# Altium schematic sheet 04 USB7002-PartA.SchDoc: USB7002 - Part A
size 420 x 297 mm; SheetNumber: 3; SheetTotal: 7
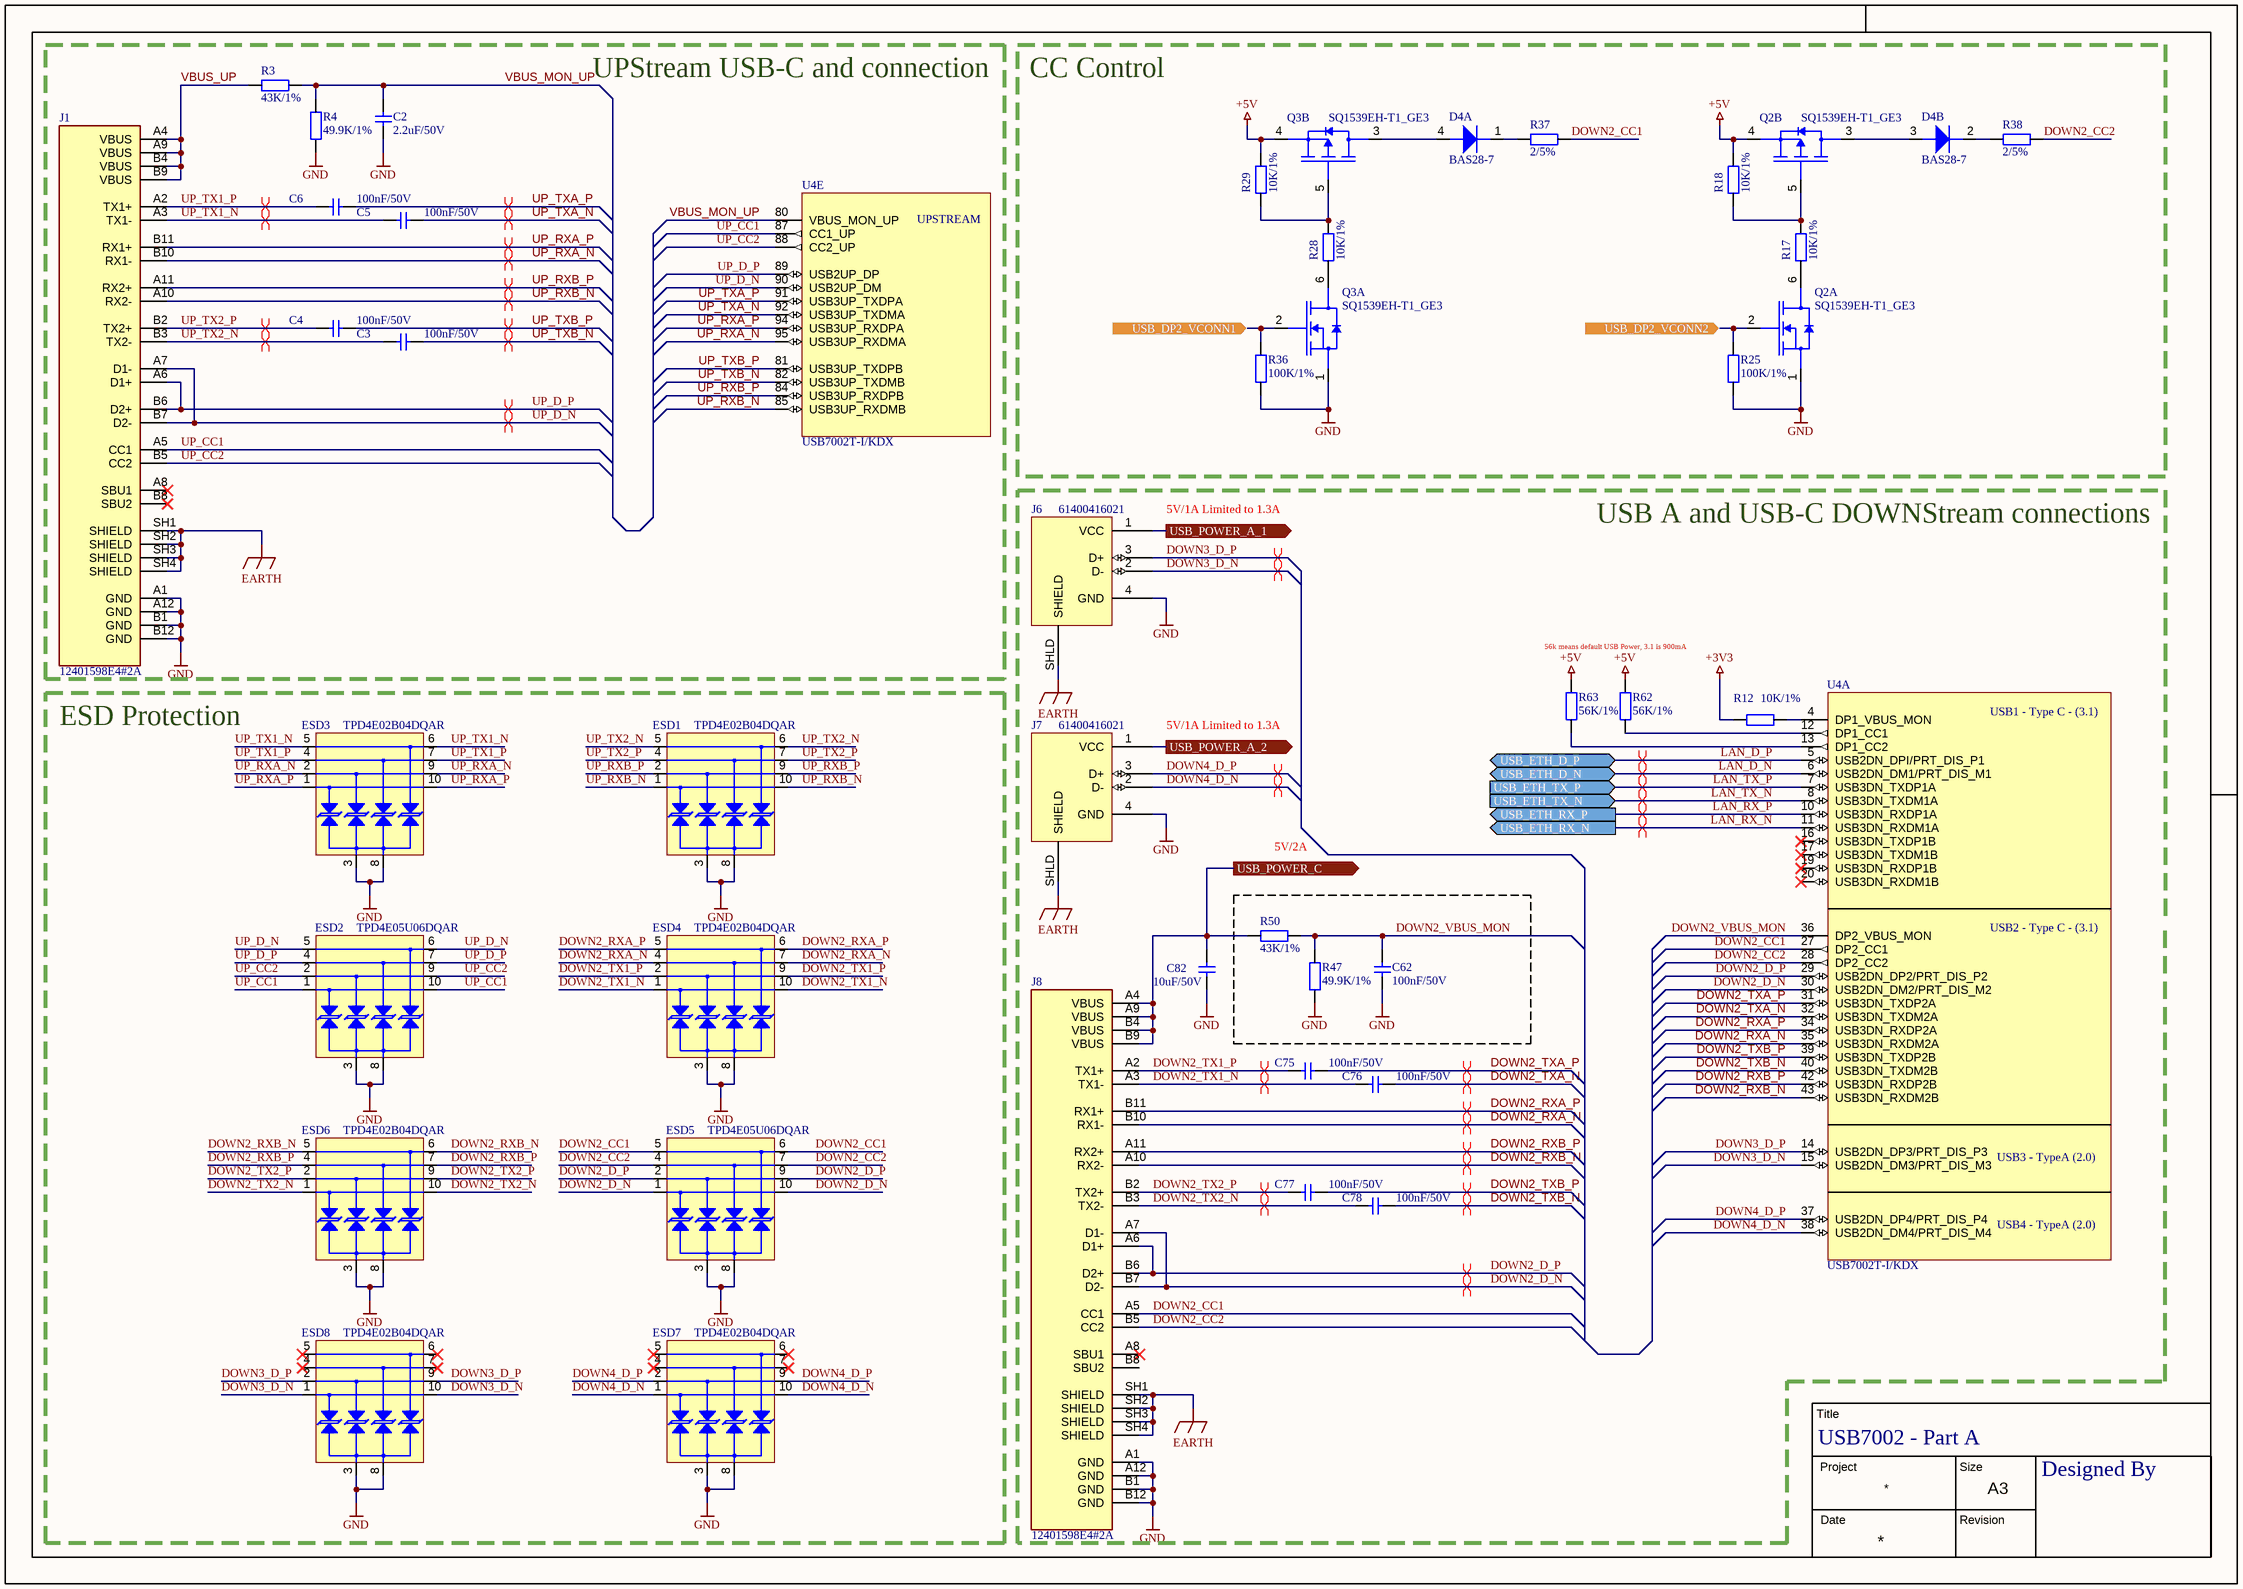
[diagram p0: 04 USB7002-PartA.SchDoc]

## Parts
C2  2.2uF/50V  [INDC1608X10N]
C3  100nF/50V  [CAPC1005X06N]
C4  100nF/50V  [CAPC1005X06N]
C5  100nF/50V  [CAPC1005X06N]
C6  100nF/50V  [CAPC1005X06N]
C62  100nF/50V  [CAPC1005X06N]
C75  100nF/50V  [CAPC1005X06N]
C76  100nF/50V  [CAPC1005X06N]
C77  100nF/50V  [CAPC1005X06N]
C78  100nF/50V  [CAPC1005X06N]
C82  10uF/50V  [CAPC3216X18N]
D4  BAS28-7  [SOT190P238X100-4L]  (parts A,B of 2)
ESD1  TPD4E02B04DQAR  [USON50P11X26X055]
ESD2  TPD4E05U06DQAR  [USON50P11X26X055]
ESD3  TPD4E02B04DQAR  [USON50P11X26X055]
ESD4  TPD4E02B04DQAR  [USON50P11X26X055]
ESD5  TPD4E05U06DQAR  [USON50P11X26X055]
ESD6  TPD4E02B04DQAR  [USON50P11X26X055]
ESD7  TPD4E02B04DQAR  [USON50P11X26X055]
ESD8  TPD4E02B04DQAR  [USON50P11X26X055]
J1  12401598E4#2A  [12401598E4#2A]
J6  61400416021  [61400416021]
J7  61400416021  [61400416021]
J8  12401598E4#2A  [12401598E4#2A]
Q2  SQ1539EH-T1_GE3  [SOT65P195X110-6N]  (parts A,B of 2)
Q3  SQ1539EH-T1_GE3  [SOT65P195X110-6N]  (parts A,B of 2)
R3  43K/1%  [RESC1005X04N]
R4  49.9K/1%  [RESC1005X04N]
R12  10K/1%  [RESC1005X04N]
R17  10K/1%  [RESC1005X04N]
R18  10K/1%  [RESC1005X04N]
R25  100K/1%  [RESC1005X04N]
R28  10K/1%  [RESC1005X04N]
R29  10K/1%  [RESC1005X04N]
R36  100K/1%  [RESC1005X04N]
R37  2/5%  [RESC1608X04N]
R38  2/5%  [RESC1608X04N]
R47  49.9K/1%  [RESC1005X04N]
R50  43K/1%  [RESC1005X04N]
R62  56K/1%  [RESC1005X04N]
R63  56K/1%  [RESC1005X04N]
U4  USB7002T-I/KDX  [QFN40P1200X1200X90_HS-101N]  (parts A,E of 5)

## Blocks framed on the sheet
UPStream USB-C and connection: C2-C6 J1 R3 R4 U4
CC Control: D4 Q2 Q3 R17 R18 R25 R28 R29 R36-R38
USB A and USB-C DOWNStream connections: C62 C75-C78 C82 J6-J8 R12 R47 R50 R62 R63 U4
ESD Protection: ESD1-ESD8

## Ports
USB_DP2_VCONN1 (in), USB_DP2_VCONN2 (in), USB_ETH_D_N (bidir), USB_ETH_D_P (bidir), USB_ETH_RX_N (out), USB_ETH_RX_P (out), USB_ETH_TX_N (in), USB_ETH_TX_P (in), USB_POWER_A_1 (out), USB_POWER_A_2 (out), USB_POWER_C (out)

## Nets
+3V3: R12.1
+5V: Q2.4 Q3.4 R18.1 R29.1 R62.1 R63.1
EARTH: J1.SH1(SHIELD) J1.SH2(SHIELD) J1.SH3(SHIELD) J1.SH4(SHIELD) J6.SHLD(SHIELD) J7.SHLD(SHIELD) J8.SH1(SHIELD) J8.SH2(SHIELD) J8.SH3(SHIELD) J8.SH4(SHIELD)
GND: C2.1 C62.2 C82.1 ESD1.3(GND) ESD1.8(GND) ESD2.3(GND) ESD2.8(GND) ESD3.3(GND) ESD3.8(GND) ESD4.3(GND) ESD4.8(GND) ESD5.3(GND) ESD5.8(GND) ESD6.3(GND) ESD6.8(GND) ESD7.3(GND) ESD7.8(GND) ESD8.3(GND) ESD8.8(GND) J1.A1(GND) J1.A12(GND) J1.B1(GND) J1.B12(GND) J6.4(GND) J7.4(GND) J8.A1(GND) J8.A12(GND) J8.B1(GND) J8.B12(GND) Q2.1(S1) Q3.1(S1) R4.1 R25.2 R36.2 R47.1
DOWN2_CC1: ESD5.5(IO4) ESD5.6(NC) J8.A5(CC1) R37.2 U4.27(DP2_CC1)
DOWN2_CC2: ESD5.4(IO3) ESD5.7(NC) J8.B5(CC2) R38.2 U4.28(DP2_CC2)
DOWN2_D_N: ESD5.1(IO1) ESD5.10(NC) J8.A7(D1-) J8.B7(D2-) U4.30(USB2DN_DM2/PRT_DIS_M2)
DOWN2_D_P: ESD5.2(IO2) ESD5.9(NC) J8.A6(D1+) J8.B6(D2+) U4.29(USB2DN_DP2/PRT_DIS_P2)
DOWN2_RXA_N: ESD4.4(IO3) ESD4.7(NC) J8.B10(RX1-) U4.35(USB3DN_RXDM2A)
DOWN2_RXA_P: ESD4.5(IO4) ESD4.6(NC) J8.B11(RX1+) U4.34(USB3DN_RXDP2A)
DOWN2_RXB_N: ESD6.5(IO4) ESD6.6(NC) J8.A10(RX2-) U4.43(USB3DN_RXDM2B)
DOWN2_RXB_P: ESD6.4(IO3) ESD6.7(NC) J8.A11(RX2+) U4.42(USB3DN_RXDP2B)
DOWN2_TX1_N: C76.2 ESD4.1(IO1) ESD4.10(NC) J8.A3(TX1-)
DOWN2_TX1_P: C75.2 ESD4.2(IO2) ESD4.9(NC) J8.A2(TX1+)
DOWN2_TX2_N: C78.2 ESD6.1(IO1) ESD6.10(NC) J8.B3(TX2-)
DOWN2_TX2_P: C77.2 ESD6.2(IO2) ESD6.9(NC) J8.B2(TX2+)
DOWN2_TXA_N: C76.1 U4.32(USB3DN_TXDM2A)
DOWN2_TXA_P: C75.1 U4.31(USB3DN_TXDP2A)
DOWN2_TXB_N: C78.1 U4.40(USB3DN_TXDM2B)
DOWN2_TXB_P: C77.1 U4.39(USB3DN_TXDP2B)
DOWN2_VBUS_MON: C62.1 R47.2 R50.1 U4.36(DP2_VBUS_MON)
DOWN3_D_N: ESD8.1(IO1) ESD8.10(NC) J6.2(D-) U4.15(USB2DN_DM3/PRT_DIS_M3)
DOWN3_D_P: ESD8.2(IO2) ESD8.9(NC) J6.3(D+) U4.14(USB2DN_DP3/PRT_DIS_P3)
DOWN4_D_N: ESD7.1(IO1) ESD7.10(NC) J7.2(D-) U4.38(USB2DN_DM4/PRT_DIS_M4)
DOWN4_D_P: ESD7.2(IO2) ESD7.9(NC) J7.3(D+) U4.37(USB2DN_DP4/PRT_DIS_P4)
LAN_D_N: U4.6(USB2DN_DM1/PRT_DIS_M1) ; port USB_ETH_D_N
LAN_D_P: U4.5(USB2DN_DPI/PRT_DIS_P1) ; port USB_ETH_D_P
LAN_RX_N: U4.11(USB3DN_RXDM1A) ; port USB_ETH_RX_N
LAN_RX_P: U4.10(USB3DN_RXDP1A) ; port USB_ETH_RX_P
LAN_TX_N: U4.8(USB3DN_TXDM1A) ; port USB_ETH_TX_N
LAN_TX_P: U4.7(USB3DN_TXDP1A) ; port USB_ETH_TX_P
UP_CC1: ESD2.1(IO1) ESD2.10(NC) J1.A5(CC1) U4.87(CC1_UP)
UP_CC2: ESD2.2(IO2) ESD2.9(NC) J1.B5(CC2) U4.88(CC2_UP)
UP_D_N: ESD2.5(IO4) ESD2.6(NC) J1.A7(D1-) J1.B7(D2-) U4.90(USB2UP_DM)
UP_D_P: ESD2.4(IO3) ESD2.7(NC) J1.A6(D1+) J1.B6(D2+) U4.89(USB2UP_DP)
UP_RXA_N: ESD3.2(IO2) ESD3.9(NC) J1.B10(RX1-) U4.95(USB3UP_RXDMA)
UP_RXA_P: ESD3.1(IO1) ESD3.10(NC) J1.B11(RX1+) U4.94(USB3UP_RXDPA)
UP_RXB_N: ESD1.1(IO1) ESD1.10(NC) J1.A10(RX2-) U4.85(USB3UP_RXDMB)
UP_RXB_P: ESD1.2(IO2) ESD1.9(NC) J1.A11(RX2+) U4.84(USB3UP_RXDPB)
UP_TX1_N: C5.2 ESD3.5(IO4) ESD3.6(NC) J1.A3(TX1-)
UP_TX1_P: C6.2 ESD3.4(IO3) ESD3.7(NC) J1.A2(TX1+)
UP_TX2_N: C3.2 ESD1.5(IO4) ESD1.6(NC) J1.B3(TX2-)
UP_TX2_P: C4.2 ESD1.4(IO3) ESD1.7(NC) J1.B2(TX2+)
UP_TXA_N: C5.1 U4.92(USB3UP_TXDMA)
UP_TXA_P: C6.1 U4.91(USB3UP_TXDPA)
UP_TXB_N: C3.1 U4.82(USB3UP_TXDMB)
UP_TXB_P: C4.1 U4.81(USB3UP_TXDPB)
USB_DP2_VCONN1: Q3.2(S2) R36.1 ; port USB_DP2_VCONN1
USB_DP2_VCONN2: Q2.2(S2) R25.1 ; port USB_DP2_VCONN2
USB_POWER_A_1: J6.1(VCC) ; port USB_POWER_A_1
USB_POWER_A_2: J7.1(VCC) ; port USB_POWER_A_2
USB_POWER_C: C82.2 J8.A4(VBUS) J8.A9(VBUS) J8.B4(VBUS) J8.B9(VBUS) R50.2 ; port USB_POWER_C
VBUS_MON_UP: C2.2 R3.1 R4.2 U4.80(VBUS_MON_UP)
VBUS_UP: J1.A4(VBUS) J1.A9(VBUS) J1.B4(VBUS) J1.B9(VBUS) R3.2
NetD4_1: D4.1 R37.1
NetD4_2: D4.2 R38.1
NetD4_3: D4.3 Q2.3
NetD4_4: D4.4 Q3.3
NetQ2_5: Q2.5 R17.1 R18.2
NetQ2_6: Q2.6 R17.2
NetQ3_5: Q3.5 R28.1 R29.2
NetQ3_6: Q3.6 R28.2
NetR12_2: R12.2 U4.4(DP1_VBUS_MON)
NetR62_2: R62.2 U4.12(DP1_CC1)
NetR63_2: R63.2 U4.13(DP1_CC2)

Not connected (* = marked no-connect by the designer): ESD7 4(IO3)* 5(IO4)* 6(NC)* 7(NC)*; ESD8 4(IO3)* 5(IO4)* 6(NC)* 7(NC)*; J1 A8(SBU1)* B8(SBU2)*; J8 A8(SBU1)* B8(SBU2); U4 16(USB3DN_TXDP1B)* 17(USB3DN_TXDM1B)* 19(USB3DN_RXDP1B)* 20(USB3DN_RXDM1B)*

## Layout directives
differential pair; differential pair class UP_SS: UP_RXA_N, UP_RXA_P, UP_RXB_N, UP_RXB_P, UP_TX1_N, UP_TX1_P, UP_TX2_N, UP_TX2_P, UP_TXA_N, UP_TXA_P, UP_TXB_N, UP_TXB_P
differential pair; differential pair class UP_DPDN: UP_D_N, UP_D_P
differential pair; differential pair class DOWN2_SS: DOWN2_RXA_N, DOWN2_RXA_P, DOWN2_RXB_N, DOWN2_RXB_P, DOWN2_TX1_N, DOWN2_TX1_P, DOWN2_TX2_N, DOWN2_TX2_P, DOWN2_TXA_N, DOWN2_TXA_P, DOWN2_TXB_N, DOWN2_TXB_P
differential pair; differential pair class DOWN2_DPDM: DOWN2_D_N, DOWN2_D_P
differential pair; differential pair class DOWN3_DPDN: DOWN3_D_N, DOWN3_D_P
differential pair; differential pair class DOWN4_DPDN: DOWN4_D_N, DOWN4_D_P
differential pair; differential pair class USB_ETH: LAN_D_N, LAN_D_P
differential pair; differential pair class USB_ETH_SS: LAN_RX_N, LAN_RX_P, LAN_TX_N, LAN_TX_P

## Notes on the sheet
- 5V/1A Limited to 1.3A
- 56k means default USB Power, 3.1 is 900mA
- 5V/2A
- Title
- Project
- Size
- Date
- Revision
- A3
- Designed By
- (in symbol USB7002T-I/KDX, part A) USB1 - Type C - (3.1); USB2 - Type C - (3.1); USB3 - TypeA (2.0); USB4 - TypeA (2.0)
- (in symbol USB7002T-I/KDX, part E) UPSTREAM

## Library data of the parts
C2 = GRT188R61H225ME13D: 2.2 µF ±20% 50V Ceramic Capacitor X5R 0603 (1608 Metric); manufacturer: Murata Electronics; mfr_part_number: GRT188R61H225ME13D; assembler_number: GRT188R61H225ME13D; datasheet: https://search.murata.co.jp/Ceramy/image/img/A01X/G101/ENG/GRT188R61H225ME13-01.pdf
C3-C6 C62 C75-C78 = GCM155R71H104KE02J: 0.1 µF ±10% 50V Ceramic Capacitor X7R 0402 (1005 Metric); manufacturer: Murata Electronics; mfr_part_number: GCM155R71H104KE02J; assembler_number: GCM155R71H104KE02J; datasheet: https://search.murata.co.jp/Ceramy/image/img/A01X/G101/ENG/GCM155R71H104KE02-01.pdf
C82 = GRT31CR61H106ME01L: 10 µF ±20% 50V Ceramic Capacitor X5R 1206 (3216 Metric); manufacturer: Murata Electronics; mfr_part_number: GRT31CR61H106ME01L; assembler_number: GRT31CR61H106ME01L; datasheet: https://search.murata.co.jp/Ceramy/image/img/A01X/G101/ENG/GRT31CR61H106ME01-01.pdf
D4 = BAS28-7: Diode Array 2 Independent 85 V 215mA (DC) Surface Mount TO-253-4, TO-253AA; manufacturer: Diodes Incorporated; mfr_part_number: BAS28-7; assembler_number: BAS28-7; datasheet: https://www.diodes.com/assets/Datasheets/BAS28.pdf
ESD1 ESD3 ESD4 ESD6-ESD8 = TPD4E02B04DQAR: 8.8V (Typ) Clamp 5A (8/20µs) Ipp Tvs Diode Surface Mount 10-USON (2.5x1); manufacturer: Texas Instruments; mfr_part_number: TPD4E02B04DQAR; assembler_number: TPD4E02B04DQAR; datasheet: https://www.ti.com/general/docs/suppproductinfo.tsp?distId=10&gotoUrl=https%3A%2F%2Fwww.ti.com%2Flit%2Fgpn%2Ftpd4e05u06
ESD2 ESD5 = TPD4E05U06DQAR: 14V Clamp 2.5A (8/20µs) Ipp Tvs Diode Surface Mount 10-USON (2.5x1); manufacturer: Texas Instruments; mfr_part_number: TPD4E05U06DQAR; assembler_number: TPD4E05U06DQAR; datasheet: https://www.ti.com/general/docs/suppproductinfo.tsp?distId=10&gotoUrl=https%3A%2F%2Fwww.ti.com%2Flit%2Fgpn%2Ftpd4e05u06
J1 J8 = 12401598E4#2A: USB-C (USB TYPE-C) USB 3.2 Gen 2 (USB 3.1 Gen 2, Superspeed + (USB 3.1)) Receptacle Connector 24 Position Surface Mount, Right Angle; Through Hole; manufacturer: Amphenol ICC (Commercial Products); mfr_part_number: 12401598E4#2A; assembler_number: 12401598E4#2A; datasheet: https://www.amphenol-cs.com/media/wysiwyg/files/drawing/12401598xxx2a.pdf
J6 J7 = 61400416021: USB-A (USB TYPE-A) USB 2.0 Receptacle Connector 4 Position Through Hole, Right Angle; manufacturer: Würth Elektronik; mfr_part_number: 61400416021; assembler_number: 61400416021; datasheet: https://media.digikey.com/pdf/Data%20Sheets/Wurth%20Electronics%20PDFs/Communication%20Conn%20WR-COM.pdf
Q2 Q3 = SQ1539EH-T1_GE3: Mosfet Array 30V 850mA (Tc) 1.5W Surface Mount PowerPAK® SC-70-6 Dual; manufacturer: Vishay Siliconix; mfr_part_number: SQ1539EH-T1_GE3; assembler_number: SQ1539EH-T1_GE3; datasheet: https://www.vishay.com/docs/62993/sq1539eh.pdf
R3 R50 = ERJ-2RKF4302X: 43 kOhms ±1% 0.1W, 1/10W Chip Resistor 0402 (1005 Metric) Automotive AEC-Q200 Thick Film; manufacturer: Panasonic Electronic Components; mfr_part_number: ERJ-2RKF4302X; assembler_number: ERJ-2RKF4302X; datasheet: https://industrial.panasonic.com/cdbs/www-data/pdf/RDA0000/AOA0000C304.pdf
R4 R47 = ERJ-2RKF4992X: 49.9 kOhms ±1% 0.1W, 1/10W Chip Resistor 0402 (1005 Metric) Automotive AEC-Q200 Thick Film; manufacturer: Panasonic Electronic Components; mfr_part_number: ERJ-2RKF4992X; assembler_number: ERJ-2RKF4992X; datasheet: https://industrial.panasonic.com/cdbs/www-data/pdf/RDA0000/AOA0000C304.pdf
R12 R17 R18 R28 R29 = RMCF0402FT10K0: 10 kOhms ±1% 0.063W, 1/16W Chip Resistor 0402 (1005 Metric) Automotive AEC-Q200 Thick Film; manufacturer: Stackpole Electronics Inc; mfr_part_number: RMCF0402FT10K0; assembler_number: RMCF0402FT10K0; datasheet: https://www.seielect.com/Catalog/SEI-RMCF_RMCP.pdf
R25 R36 = RMCF0402FT100K: 100 kOhms ±1% 0.063W, 1/16W Chip Resistor 0402 (1005 Metric) Automotive AEC-Q200 Thick Film; manufacturer: Stackpole Electronics Inc; mfr_part_number: RMCF0402FT100K; assembler_number: RMCF0402FT100K; datasheet: https://www.seielect.com/Catalog/SEI-RMCF_RMCP.pdf
R37 R38 = ERJ-PA3J2R0V: 2 Ohms ±5% 0.333W, 1/3W Chip Resistor 0603 (1608 Metric) Automotive AEC-Q200, Pulse Withstanding Thick Film; manufacturer: Panasonic Electronic Components; mfr_part_number: ERJ-PA3J2R0V; assembler_number: ERJ-PA3J2R0V; datasheet: https://industrial.panasonic.com/cdbs/www-data/pdf/RDO0000/AOA0000C331.pdf
R62 R63 = ERJ-2RKF5602X: 56 kOhms ±1% 0.1W, 1/10W Chip Resistor 0402 (1005 Metric) Automotive AEC-Q200 Thick Film; manufacturer: Panasonic Electronic Components; mfr_part_number: ERJ-2RKF5602X; assembler_number: ERJ-2RKF5602X; datasheet: https://industrial.panasonic.com/cdbs/www-data/pdf/RDA0000/AOA0000C304.pdf
U4 = USB7002T-I/KDX: USB Hub Controller USB 3.1 USB Interface 100-VQFN (12x12); manufacturer: Microchip Technology; mfr_part_number: USB7002T-I/KDX; assembler_number: USB7002T-I/KDX; datasheet: https://ww1.microchip.com/downloads/en/DeviceDoc/USB7002-Data-Sheet-DS00002670F.pdf